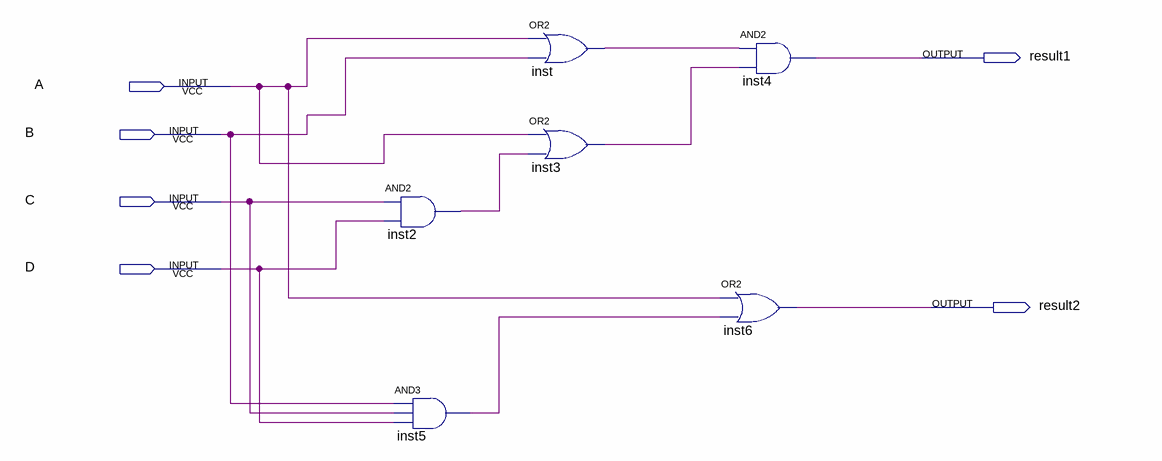
[diagram p0: schematic sheet]
// Quartus schematic practiceTwoByOne.bdf as structural Verilog: 6 symbols, 6 pins
module practiceTwoByOne (
  input  A,
  input  B,
  input  C,
  input  D,
  output result1,
  output result2
);

  wire inst2_out, inst3_out, inst5_out, inst_out;

  and inst2 (inst2_out, C, D);
  and inst5 (inst5_out, B, C, D);
  or inst (inst_out, A, B);
  or inst3 (inst3_out, A, inst2_out);
  and inst4 (result1, inst_out, inst3_out);
  or inst6 (result2, A, inst5_out);
endmodule
